# Altium schematic sheet SignalConditioning.SchDoc
size 431 x 279 mm; Organization: ORGANIZATION; Address1: ADDRESS 1; Address2: ADDRESS 2; Address3: ADDRESS 3; Address4: ADDRESS 4; Revision: -; SheetNumber: 2; SheetTotal: 2; ENG_APP_DATE: --/--/--; DSN_APP_DATE: --/--/--; CHK_APP_DATE: --/--/--
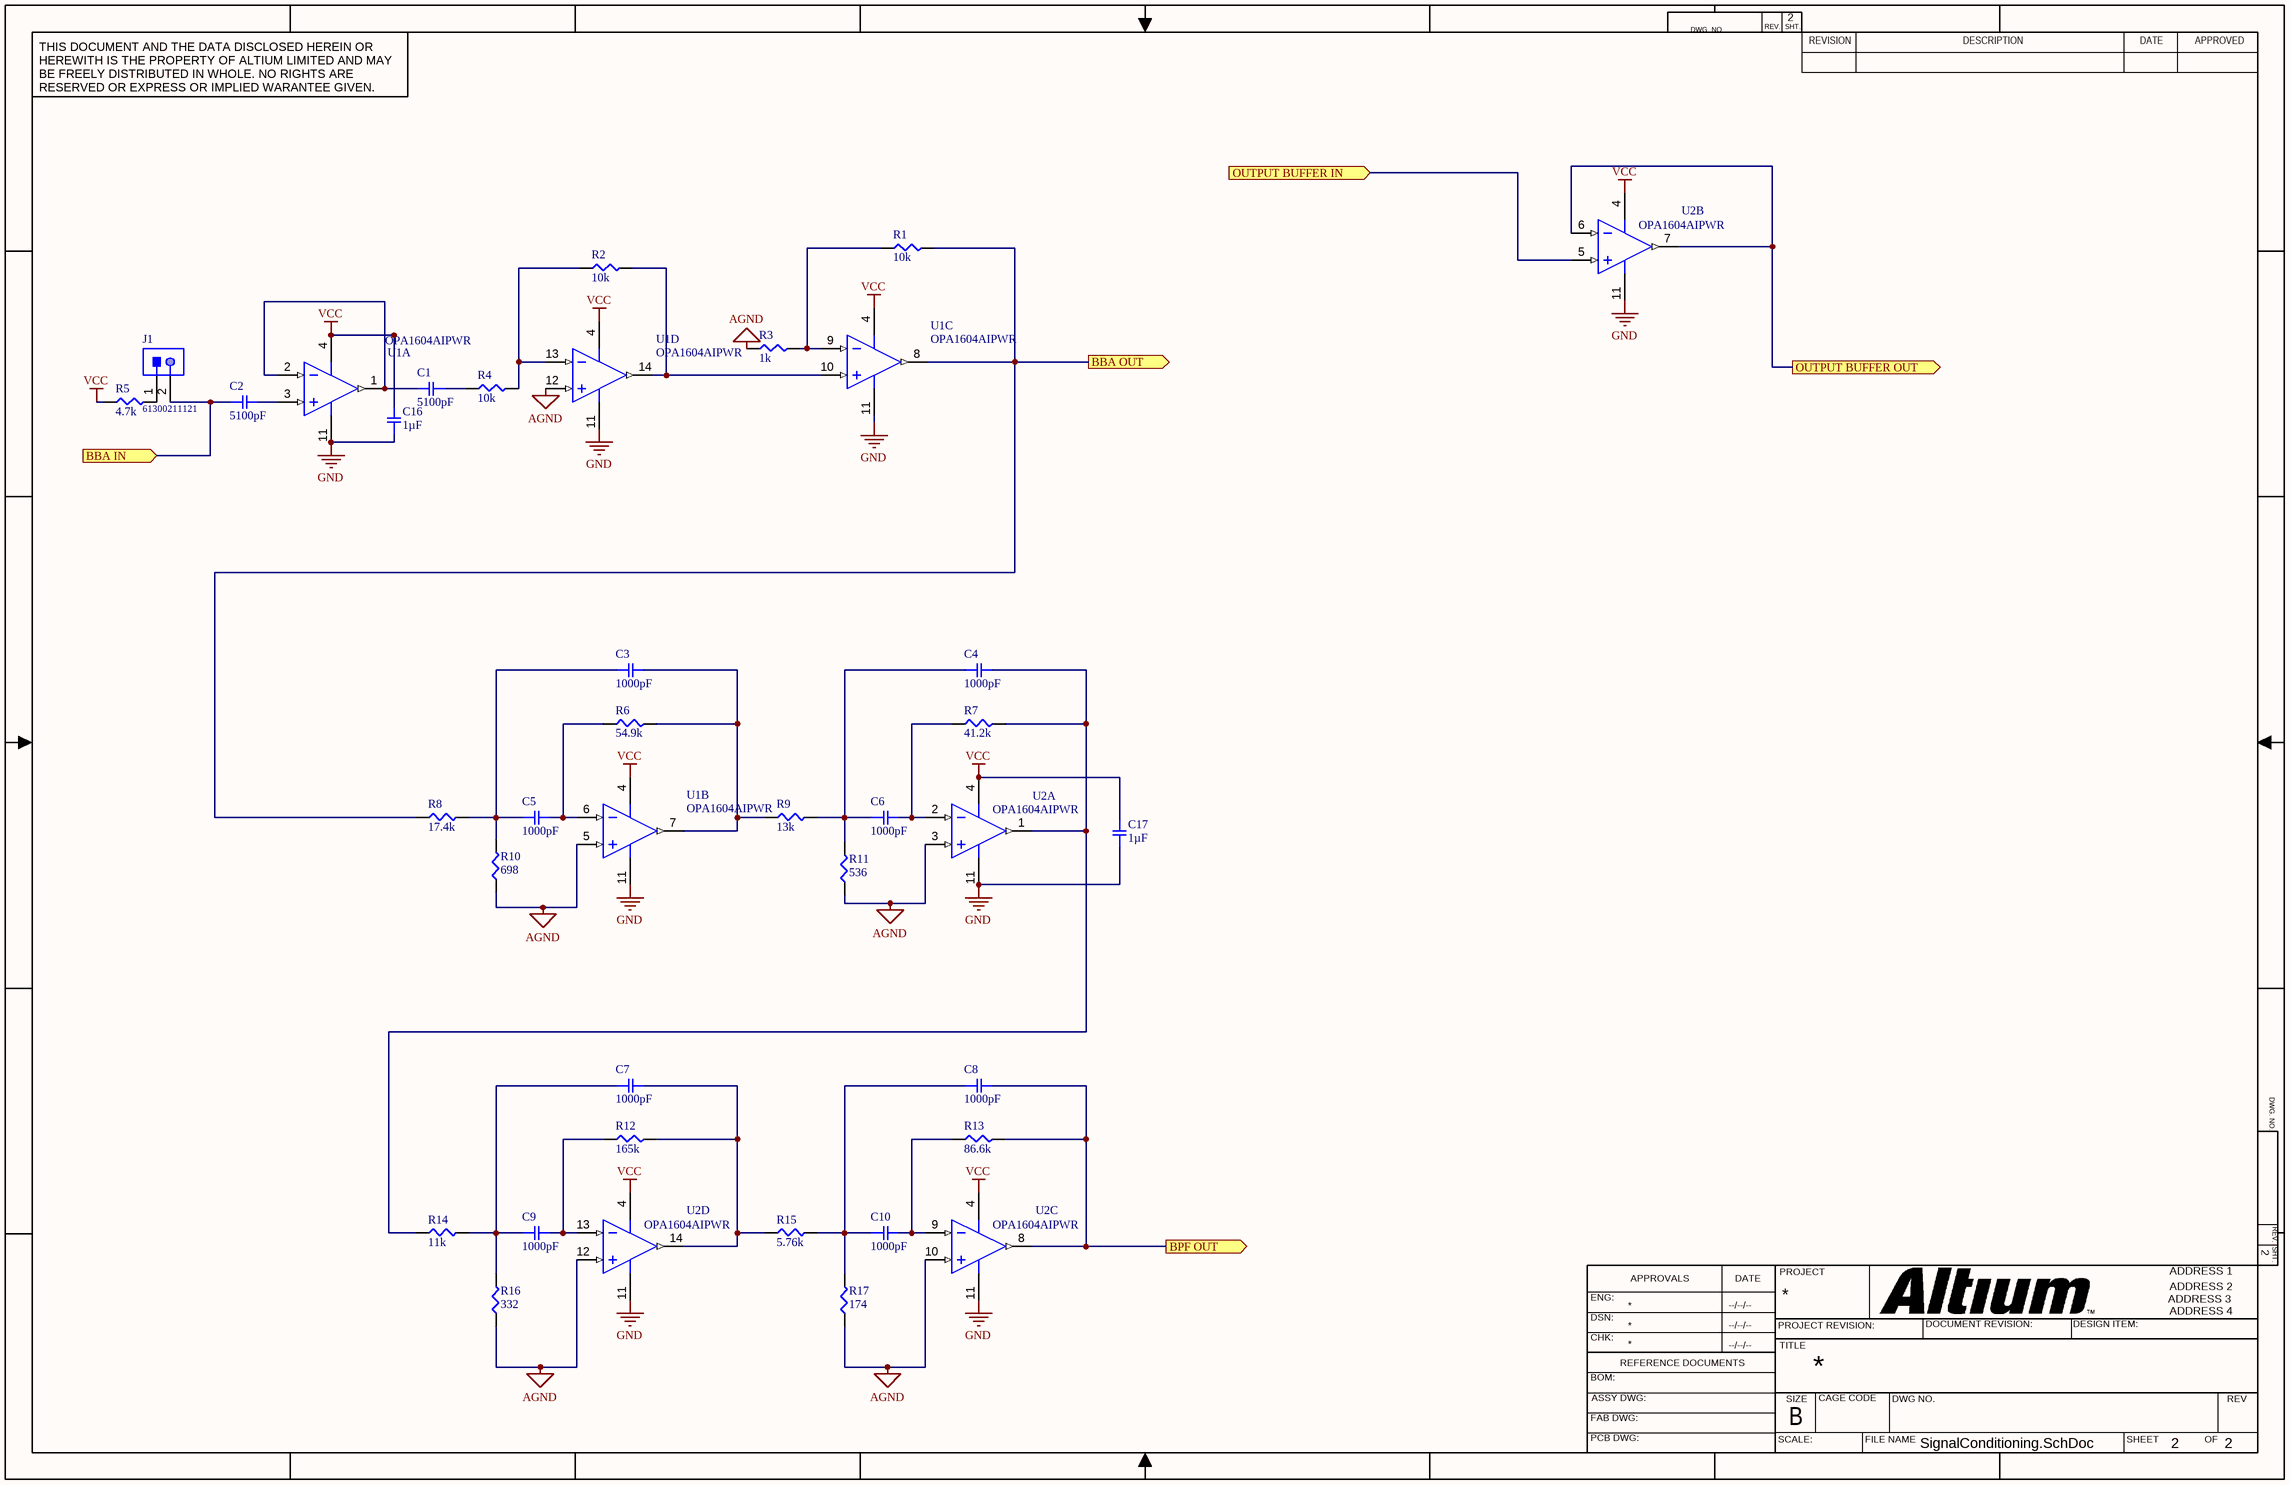
[diagram p0: SignalConditioning.SchDoc]

## Parts
C1  5100pF  [SMD-0603C]
C2  5100pF  [SMD-0603C]
C3  1000pF  [SMD-0603C]
C4  1000pF  [SMD-0603C]
C5  1000pF  [SMD-0603C]
C6  1000pF  [SMD-0603C]
C7  1000pF  [SMD-0603C]
C8  1000pF  [SMD-0603C]
C9  1000pF  [SMD-0603C]
C10  1000pF  [SMD-0603C]
C16  1µF  [SMD-0603C]
C17  1µF  [SMD-0603C]
J1  61300211121  [61300211121]
R1  10k  [SMD-0603-RES]
R2  10k  [SMD-0603-RES]
R3  1k  [SMD-0603-RES]
R4  10k  [SMD-0603-RES]
R5  4.7k  [SMD-0603-RES]
R6  54.9k  [SMD-0603-RES]
R7  41.2k  [SMD-0603-RES]
R8  17.4k  [SMD-0603-RES]
R9  13k  [SMD-0603-RES]
R10  698  [SMD-0603-RES]
R11  536  [SMD-0603-RES]
R12  165k  [SMD-0603-RES]
R13  86.6k  [SMD-0603-RES]
R14  11k  [SMD-0603-RES]
R15  5.76k  [SMD-0603-RES]
R16  332  [SMD-0603-RES]
R17  174  [SMD-0603-RES]
U1  OPA1604AIPWR  [PW0014A_N]  (parts A,B,C,D of 4)
U2  OPA1604AIPWR  [PW0014A_N]  (parts A,B,C,D of 4)

## Ports
BBA IN (in), BBA OUT (out), BPF OUT (out), OUTPUT BUFFER IN (in), OUTPUT BUFFER OUT (out)

## Nets
AGND: R3.1 R10.1 R11.1 R16.1 R17.1 U1.5(IN_B+) U1.12(IN_D+) U2.3(IN_A+) U2.10(IN_C+) U2.12(IN_D+)
GND: C16.1 C17.1 U1.11(V-) U2.11(V-)
VCC: C16.2 C17.2 R5.1 U1.4(V+) U2.4(V+)
BBA IN: C2.1 J1.2 ; port BBA IN
BBA OUT: R1.2 R8.1 U1.8(OUT_C) ; port BBA OUT
BPF OUT: C8.2 R13.2 U2.8(OUT_C) ; port BPF OUT
OUTPUT BUFFER IN: U2.5(IN_B+) ; port OUTPUT BUFFER IN
OUTPUT BUFFER OUT: U2.6(IN_B-) U2.7(OUT_B) ; port OUTPUT BUFFER OUT
NetC1_1: C1.1 R4.1
NetC1_2: C1.2 U1.1(OUT_A) U1.2(IN_A-)
NetC2_2: C2.2 U1.3(IN_A+)
NetC3_1: C3.1 C5.1 R8.2 R10.2
NetC3_2: C3.2 R6.2 R9.1 U1.7(OUT_B)
NetC4_1: C4.1 C6.1 R9.2 R11.2
NetC4_2: C4.2 R7.2 R14.1 U2.1(OUT_A)
NetC5_2: C5.2 R6.1 U1.6(IN_B-)
NetC6_2: C6.2 R7.1 U2.2(IN_A-)
NetC7_1: C7.1 C9.1 R14.2 R16.2
NetC7_2: C7.2 R12.2 R15.1 U2.14(OUT_D)
NetC8_1: C8.1 C10.1 R15.2 R17.2
NetC9_2: C9.2 R12.1 U2.13(IN_D-)
NetC10_2: C10.2 R13.1 U2.9(IN_C-)
NetJ1_1: J1.1 R5.2
NetR1_1: R1.1 R3.2 U1.9(IN_C-)
NetR2_1: R2.1 R4.2 U1.13(IN_D-)
NetR2_2: R2.2 U1.10(IN_C+) U1.14(OUT_D)

## Notes on the sheet
- DWG. NO.
- REV.
- SHT.
- THIS DOCUMENT AND THE DATA DISCLOSED HEREIN OR HEREWITH IS THE PROPERTY OF ALTIUM LIMITED AND MAY BE FREELY DISTRIBUTED IN WHOLE. NO RIGHTS ARE RESERVED OR EXPRESS OR IMPLIED WARANTEE GIVEN.
- REVISION
- DESCRIPTION
- DATE
- APPROVED
- ENG:
- APPROVALS
- PROJECT
- DSN:
- CHK:
- REFERENCE DOCUMENTS
- PROJECT REVISION:
- TITLE
- DOCUMENT REVISION:
- DESIGN ITEM:
- BOM:
- FAB DWG:
- PCB DWG:
- ASSY DWG:
- SCALE:
- SIZE
- B
- CAGE CODE
- FILE NAME
- DWG NO.
- SHEET
- OF
- REV

## Library data of the parts
C1 = GRM1887U1H512JA01D: CAP CER 5100PF 50V U2J 0603; Manufacturer: Murata Electronics North America; Value: 5100pF; Operating Temperature: -55°C ~ 125°C; Package / Case: 0603 (1608 Metric); Datasheet Link: https://www.digikey.com/en/products/detail/murata-electronics/GRM1887U1H512JA01D/2612102; Manufacturer Part Number: GRM1887U1H512JA01D
C2 = GRM1887U1H512JA01D: CAP CER 5100PF 50V U2J 0603; Manufacturer: Murata Electronics North America; Factory Stock: 0; Unit Price (USD): 0.2; Minimum Quantity: 1; Tolerance: ±5%; Datasheets: http://www.murata.com/~/media/webrenewal/support/library/catalog/products/capacitor/mlcc/c02e.pdf; Image: //media.digikey.com/Renders/Murata%20Renders/ZRB-SERIES-0402.jpg; Digi-Key Part Number: 490-6399-1-ND; Part Number: GRM1887U1H512JA01D; Quantity Available: 12288; @ qty: 0; Packaging: Cut Tape (CT); Series: GRM; Part Status: Active; Value: 5100pF; Voltage: 50V; Temperature Coefficient: U2J; Operating Temperature: -55°C ~ 125°C; Features: -; Ratings: -; Applications: General Purpose; Mounting Type: Surface Mount, MLCC; Package / Case: 0603 (1608 Metric); Size / Dimension: 0.063" L x 0.031" W (1.60mm x 0.80mm); Height - Seated (Max): -; Thickness (Max): 0.035" (0.90mm); Lead Spacing: -; Lead Style: -
C3-C10 = GCJ188R71H102KA01D: CAP CER 1000PF 50V X7R 0603; Manufacturer: Walsin Technology Corporation; Manufacturer Part Number: 0603N102F500CT; Value: 1000pF; Operating Temperature: -55°C ~ 125°C; Package / Case: 0603 (1608 Metric); Datasheet Link: https://www.digikey.com/en/products/detail/walsin-technology-corporation/0603N102F500CT/9354972
C16 C17 = GCM188R71C105KA64D: CAP CER 1UF 16V X7R 0603; Manufacturer: Samsung Electro-Mechanics; Manufacturer Part Number: CL10A105KA8NNNC; Value: 1µF; Operating Temperature: -55°C ~ 125°C; Package / Case: 0603 (1608 Metric); Datasheet Link: https://www.digikey.com/en/products/detail/samsung-electro-mechanics/CL10A105KA8NNNC/3886760
J1 = CMP-1712-00002-4: THT Vertical Pin Header WR-PHD, Pitch 2.54 mm, Single Row, 2 pins; Manufacturer: Wurth Elektronik; Rated Current: 3A; Gender: Male; Withstanding Voltage: 500VAC; Working Voltage: 250VAC; Pitch: 2.54mm; Contact Resistance: 20mOhm; Pin Number: 2; Mounting Technology: THT; Orientation: Vertical; Operating Temperature: -40to105degC; Packaging: Bag; Publisher: WurthElektronik; Datasheet URL: https://katalog.we-online.de/em/datasheet/6130xx11121.pdf; Manufacturer URL: http://www.we-online.de; Row Number: Single; Package Reference: 61300211121; Part Number: 61300211121
R1 R2 R4 = ERJ-3EKF1002V: RES SMD 10K OHM 1% 1/10W 0603; Manufacturer: Panasonic Electronic Components; Manufacturer Part Number: RNCP0603FTD10K0; Value: 10k; Operating Temperature: -55°C ~ 155°C; Package / Case: 0603 (1608 Metric); Datasheet Link: https://www.digikey.com/en/products/detail/stackpole-electronics-inc/RNCP0603FTD10K0/2240139
R3 = ERJ-3EKF1001V: RES SMD 1K OHM 1% 1/10W 0603; Manufacturer: Stackpole Electronics Inc; Manufacturer Part Number: RNCP0603FTD1K00; Value: 1k; Operating Temperature: -55°C ~ 155°C; Package / Case: 0603 (1608 Metric); Datasheet Link: https://www.digikey.com/en/products/detail/stackpole-electronics-inc/RNCP0603FTD1K00/2240106
R5 = ERJ-3EKF4701V: RES SMD 4.7K OHM 1% 1/10W 0603; Manufacturer: Panasonic Electronic Components; Value: 4.7k; Operating Temperature: -55°C ~ 155°C; Package / Case: 0603 (1608 Metric); Datasheet Link: https://www.digikey.com/en/products/detail/panasonic-electronic-components/ERJ-3EKF4701V/1746419; Manufacturer Part Number: ERJ-3EKF4701V
R6 = ERJ-3EKF5492V: RES SMD 54.9K OHM 1% 1/10W 0603; Manufacturer: Panasonic Electronic Components; Value: 54.9k; Operating Temperature: -55°C ~ 155°C; Package / Case: 0603 (1608 Metric); Datasheet Link: https://www.digikey.com/en/products/detail/panasonic-electronic-components/ERJ-3EKF5492V/196403; Manufacturer Part Number: ERJ-3EKF5492V
R7 = ERJ-3EKF4122V: RES SMD 41.2K OHM 1% 1/10W 0603; Manufacturer: Panasonic Electronic Components; Value: 41.2k; Operating Temperature: -55°C ~ 155°C; Package / Case: 0603 (1608 Metric); Datasheet Link: https://www.digikey.com/en/products/detail/yageo/RC0603FR-0741K2L/727225; Manufacturer Part Number: ERJ-3EKF4122V
R8 = ERJ-3EKF1742V: RES SMD 17.4K OHM 1% 1/10W 0603; Manufacturer: Panasonic Electronic Components; Value: 17.4k; Operating Temperature: -55°C ~ 155°C; Package / Case: 0603 (1608 Metric); Datasheet Link: https://www.digikey.com/en/products/detail/panasonic-electronic-components/ERJ-3EKF1742V/196159; Manufacturer Part Number: ERJ-3EKF1742V
R9 = ERJ-3EKF1302V: RES SMD 13K OHM 1% 1/10W 0603; Manufacturer: Panasonic Electronic Components; Value: 13k; Operating Temperature: -55°C ~ 155°C; Package / Case: 0603 (1608 Metric); Datasheet Link: https://www.digikey.com/en/products/detail/panasonic-electronic-components/ERJ-3EKF1302V/196110; Manufacturer Part Number: ERJ-3EKF1302V
R10 = ERJ-3EKF6980V: RES SMD 698 OHM 1% 1/10W 0603; Manufacturer: Panasonic Electronic Components; Value: 698; Operating Temperature: -55°C ~ 155°C; Package / Case: 0603 (1608 Metric); Datasheet Link: https://www.digikey.com/en/products/detail/panasonic-electronic-components/ERJ-3EKF6980V/196453; Manufacturer Part Number: ERJ-3EKF6980V
R11 = ERJ-3EKF5360V: RES SMD 536 OHM 1% 1/10W 0603; Manufacturer: Panasonic Electronic Components; Value: 536; Operating Temperature: -55°C ~ 155°C; Package / Case: 0603 (1608 Metric); Datasheet Link: https://www.digikey.com/en/products/detail/panasonic-electronic-components/ERJ-3EKF5360V/196400; Manufacturer Part Number: ERJ-3EKF5360V
R12 = ERJ-3EKF1653V: RES SMD 165K OHM 1% 1/10W 0603; Manufacturer: Panasonic Electronic Components; Value: 165k; Operating Temperature: -55°C ~ 155°C; Package / Case: 0603 (1608 Metric); Datasheet Link: https://www.digikey.com/en/products/detail/panasonic-electronic-components/ERJ-3EKF1653V/196155; Manufacturer Part Number: ERJ-3EKF1653V
R13 = ERJ-3EKF8662V: RES SMD 86.6K OHM 1% 1/10W 0603; Manufacturer: Panasonic Electronic Components; Value: 86.6k; Operating Temperature: -55°C ~ 155°C; Package / Case: 0603 (1608 Metric); Datasheet Link: https://www.digikey.com/en/products/detail/panasonic-electronic-components/ERJ-3EKF8662V/196500; Manufacturer Part Number: ERJ-3EKF8662V
R14 = ERJ-3EKF1102V: RES SMD 11K OHM 1% 1/10W 0603; Manufacturer: Panasonic Electronic Components; Value: 11k; Operating Temperature: -55°C ~ 155°C; Package / Case: 0603 (1608 Metric); Datasheet Link: https://www.digikey.com/en/products/detail/panasonic-electronic-components/ERJ-3EKF1102V/196083; Manufacturer Part Number: ERJ-3EKF1102V
R15 = ERJ-3EKF5761V: RES SMD 5.76K OHM 1% 1/10W 0603; Manufacturer: Panasonic Electronic Components; Value: 5.76k; Operating Temperature: -55°C ~ 155°C; Package / Case: 0603 (1608 Metric); Datasheet Link: https://www.digikey.com/en/products/detail/panasonic-electronic-components/ERJ-3EKF5761V/196388; Manufacturer Part Number: ERJ-3EKF5761V
R16 = ERJ-3EKF3320V: RES SMD 332 OHM 1% 1/10W 0603; Manufacturer: Panasonic Electronic Components; Value: 332; Operating Temperature: -55°C ~ 155°C; Package / Case: 0603 (1608 Metric); Datasheet Link: https://www.digikey.com/en/products/detail/panasonic-electronic-components/ERJ-3EKF3320V/196300; Manufacturer Part Number: ERJ-3EKF3320V
R17 = ERJ-3EKF1740V: RES SMD 174 OHM 1% 1/10W 0603; Manufacturer: Panasonic Electronic Components; Value: 174; Operating Temperature: -55°C ~ 155°C; Package / Case: 0603 (1608 Metric); Datasheet Link: https://www.digikey.com/en/products/detail/panasonic-electronic-components/ERJ-3EKF1740V/196162; Manufacturer Part Number: ERJ-3EKF1740V
U1 U2 = CMP-0272-01731-3: Sound Plus High-Performance, Bipolar-Input Audio Operational Amplifier, 4.5 to 36 V, -40 to 85 degC, 14-pin SOP (PW14), Green (RoHS & no Sb/Br); Manufacturer: Texas Instruments; Datasheet Link: https://www.digikey.com/en/products/detail/texas-instruments/OPA1604AIPWR/2793768; Manufacturer Part Number: OPA1604AIPWR; Operating Temperature: -40°C ~ 85°C; Package / Case: 14-TSSOP